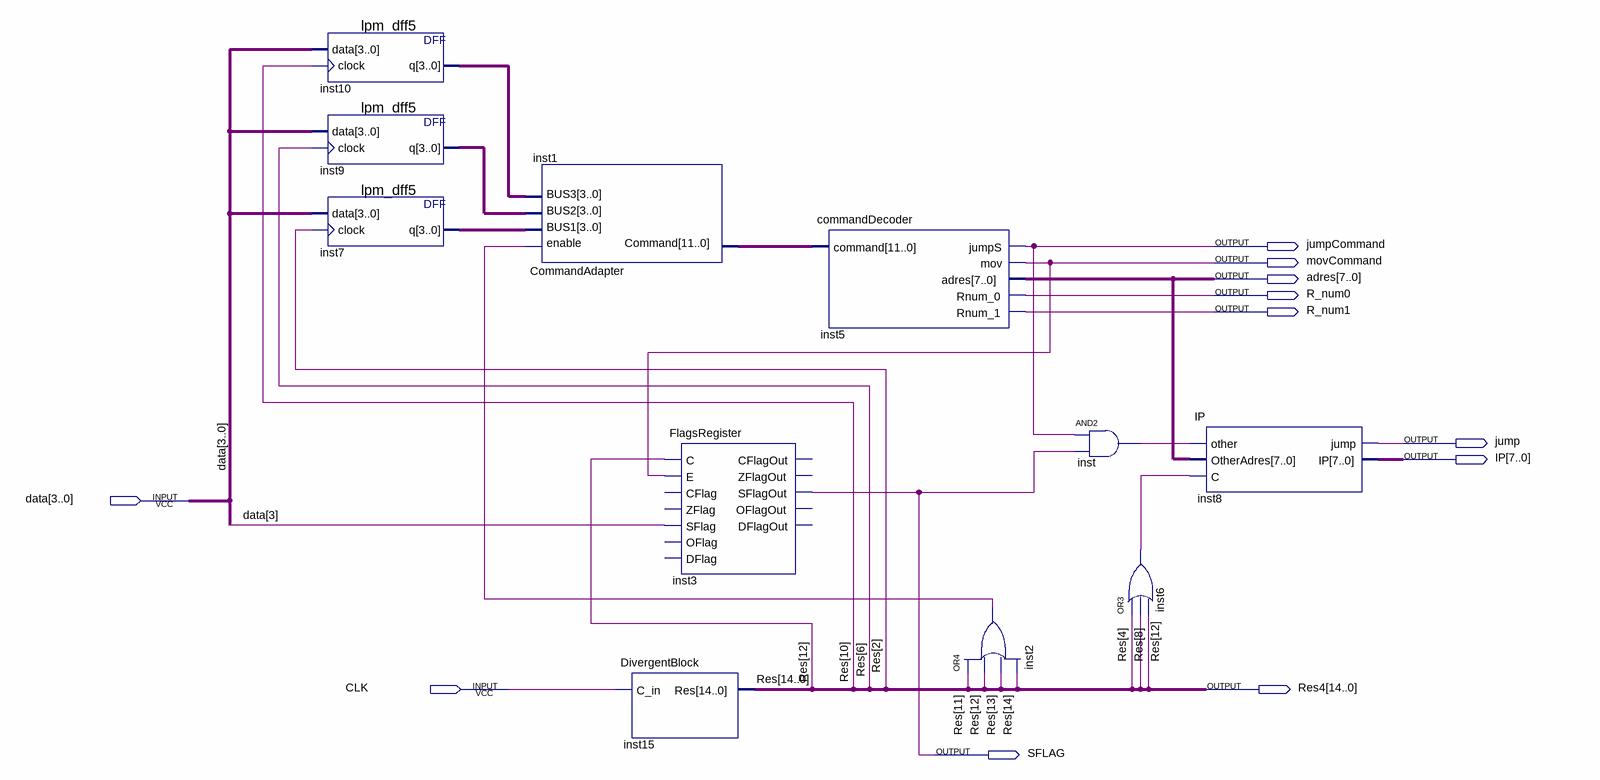
[diagram p0: schematic sheet]
// Quartus schematic Manage.bdf as structural Verilog: 11 symbols, 11 pins
module Manage (
  input  [3:0] data,
  input  CLK,
  output jumpCommand,
  output movCommand,
  output [7:0] adres,
  output R_num0,
  output R_num1,
  output jump,
  output [7:0] IP,
  output [14:0] Res4,
  output SFLAG
);

  wire inst2_out, inst6_out, inst_out;
  wire [3:0] inst7_q, inst9_q, inst10_q;
  wire [11:0] inst1_command;

  lpm_dff5 inst10 (.data(data), .clock(Res4[10]), .q(inst10_q));
  lpm_dff5 inst9 (.data(data), .clock(Res4[6]), .q(inst9_q));
  lpm_dff5 inst7 (.data(data), .clock(Res4[2]), .q(inst7_q));
  CommandAdapter inst1 (.enable(inst2_out), .BUS1(inst7_q), .BUS2(inst9_q), .BUS3(inst10_q), .Command(inst1_command));
  DivergentBlock inst15 (.C_in(CLK), .Res(Res4));
  FlagsRegister inst3 (
    .C(Res4[12]), .E(movCommand), .SFlag(data[3]), .SFlagOut(SFLAG));  // open: CFlag, ZFlag, OFlag, DFlag, CFlagOut, ZFlagOut, OFlagOut, DFlagOut
  commandDecoder inst5 (
    .command(inst1_command), .jumpS(jumpCommand), .mov(movCommand), .adres(adres), .Rnum_0(R_num0),
    .Rnum_1(R_num1));
  or inst2 (inst2_out, Res4[11], Res4[12], Res4[13], Res4[14]);
  and inst (inst_out, jumpCommand, SFLAG);
  or inst6 (inst6_out, Res4[4], Res4[8], Res4[12]);
  IP inst8 (.other(inst_out), .OtherAdres(adres), .C(inst6_out), .jump(jump), .IP(IP));

  // Other names for the same wires on the sheet: Res[14:0] = Res4
endmodule
